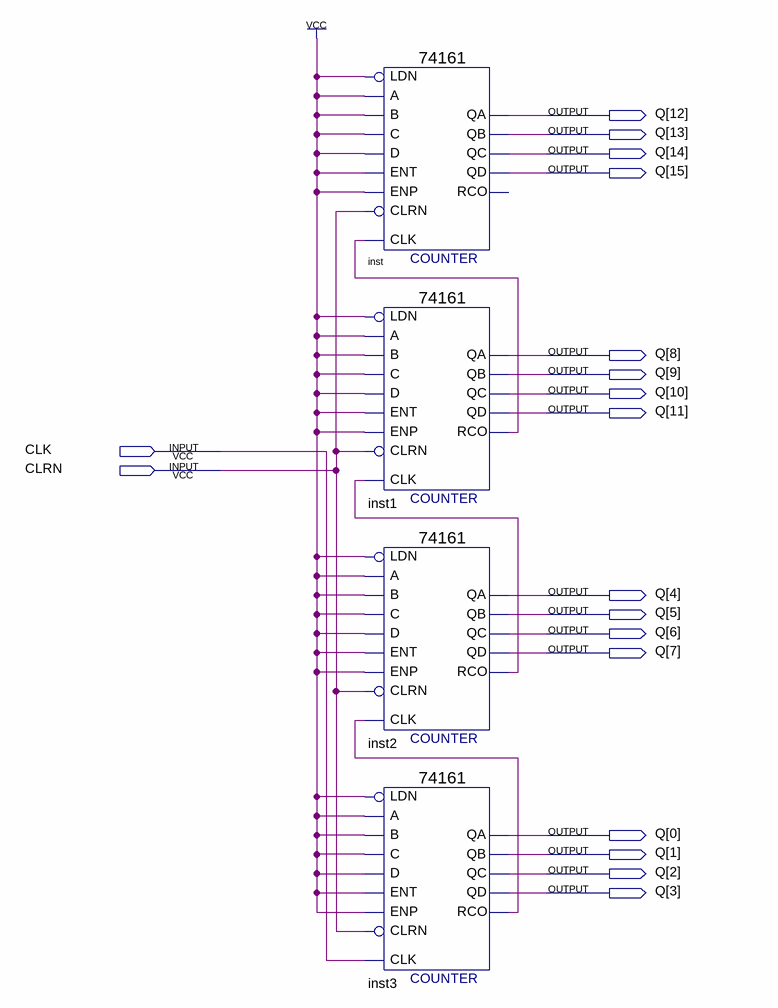
[diagram p0: schematic sheet]
// Quartus schematic 655536_Counter.bdf as structural Verilog: 4 symbols, 18 pins
module \655536_Counter  (
  input  CLK,
  input  CLRN,
  output [15:0] Q
);

  wire inst1_rco, inst2_rco, inst3_rco;

  \74161  inst (
    .CLRN(CLRN), .CLK(inst1_rco), .ENP(1'b1), .LDN(1'b1), .A(1'b1), .D(1'b1), .ENT(1'b1), .B(1'b1), .C(1'b1),
    .QD(Q[15]), .QC(Q[14]), .QB(Q[13]), .QA(Q[12]));  // open: RCO
  \74161  inst1 (
    .CLRN(CLRN), .CLK(inst2_rco), .ENP(1'b1), .LDN(1'b1), .A(1'b1), .D(1'b1), .ENT(1'b1), .B(1'b1), .C(1'b1),
    .QD(Q[11]), .QC(Q[10]), .QB(Q[9]), .QA(Q[8]), .RCO(inst1_rco));
  \74161  inst2 (
    .CLRN(CLRN), .CLK(inst3_rco), .ENP(1'b1), .LDN(1'b1), .A(1'b1), .D(1'b1), .ENT(1'b1), .B(1'b1), .C(1'b1),
    .QD(Q[7]), .QC(Q[6]), .QB(Q[5]), .QA(Q[4]), .RCO(inst2_rco));
  \74161  inst3 (
    .CLRN(CLRN), .CLK(CLK), .ENP(1'b1), .LDN(1'b1), .A(1'b1), .D(1'b1), .ENT(1'b1), .B(1'b1), .C(1'b1),
    .QD(Q[3]), .QC(Q[2]), .QB(Q[1]), .QA(Q[0]), .RCO(inst3_rco));
endmodule
